# EasyEDA Pro project ProPrj_NavBot-ES02.epro, board MAIN
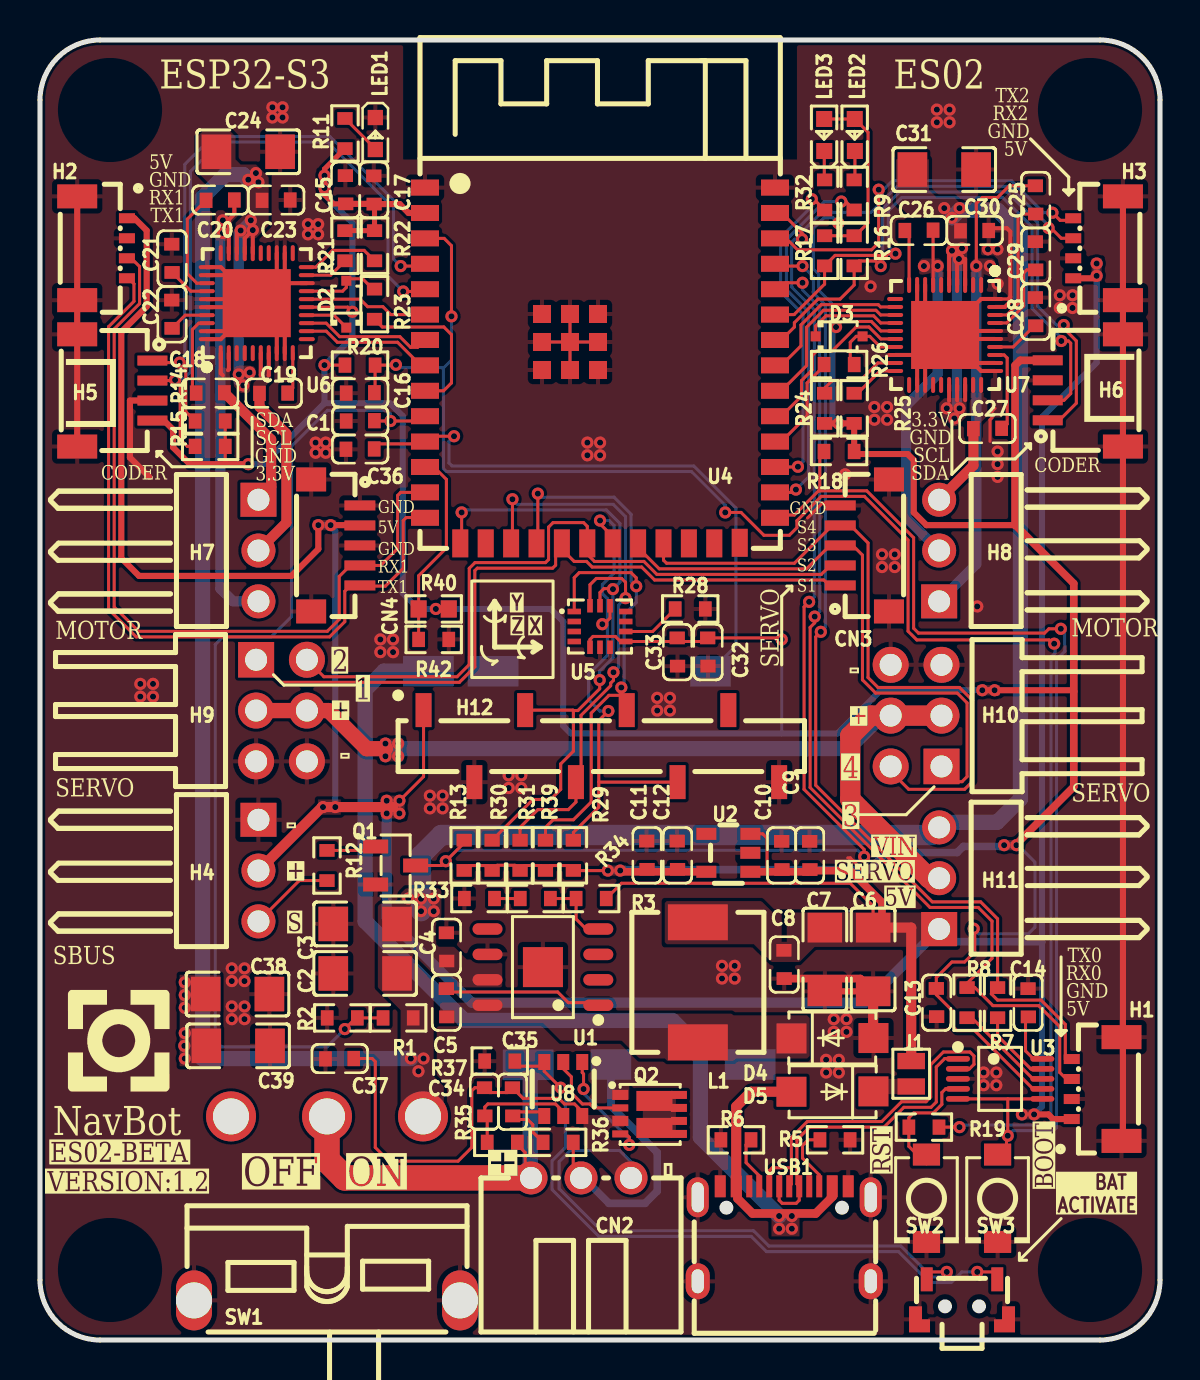
[diagram p3: board, top side]
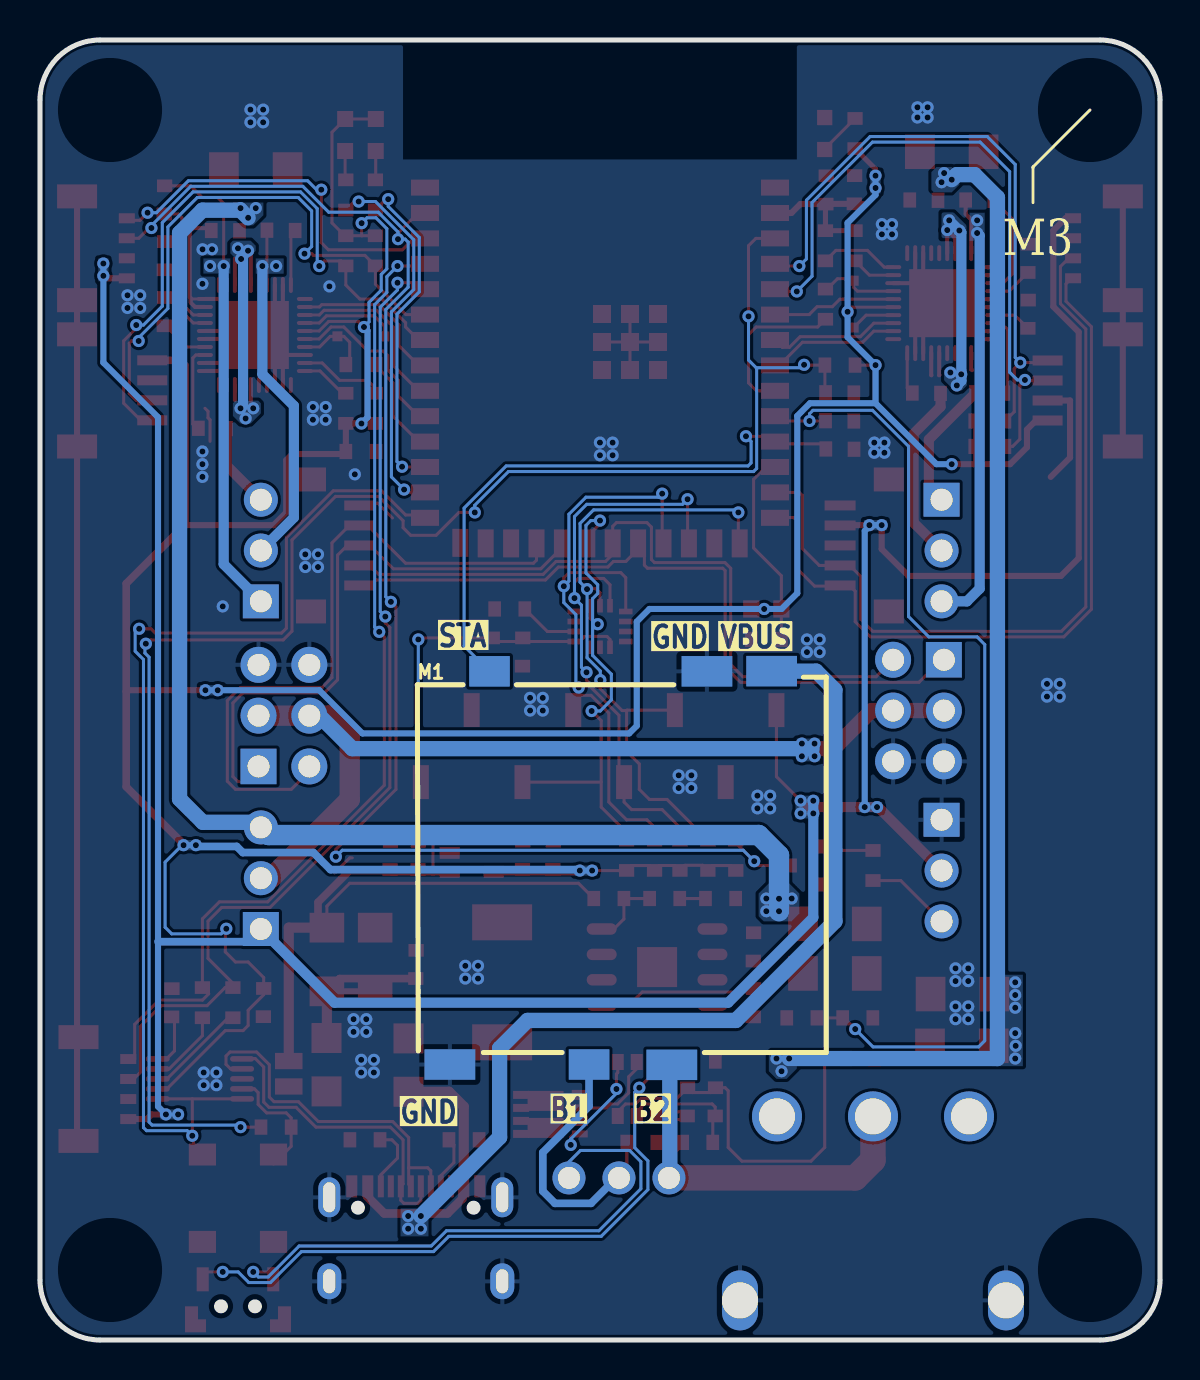
[diagram p4: board, bottom side, seen from below]

Outline 56 x 65 mm; copper layers: Top Layer, Bottom Layer. Coordinates in mm from the lower left corner of the outline.
Outline path: 0,62 0,3 arc(0.88,0.88) 3,0 53,0 arc(55.12,0.88) 56,3 56,62 arc(55.12,64.12) 53,65 3,65 arc(0.88,64.12) 0,62
Stack: Top Layer 0.035mm / Dielectric1 1.51mm FR4 er 4.5 / Bottom Layer 0.035mm

## Design rules (mm)
spacing copperThickness1oz (default): track to track 0.127, other pairs 0.127 to 0.3
spacing copperThickness2oz: track to track 0.203, other pairs 0.152 to 0.3
spacing Plane_innerPlane: track to track 0.127, other pairs 0.127 to 0.3
spacing Copper_铺铜直连: track to track 0.127, other pairs 0.127 to 0.3
spacing Copper_铺铜发散: track to track 0.127, other pairs 0.127 to 0.3
track width copperThickness1oz (default): min 0.127, default 0.152, max 2.54
track width copperThickness2oz: min 0.203, default 0.254, max 2.54
differential pair differentialPair (default): width min 0.127, default 0.254, max 2.54; gap min 0.152, default 0.152
net GND uses 铺铜发散
net W_A uses 铺铜发散
net U_B uses 铺铜发散
net V_B uses 铺铜发散
net W_B uses 铺铜发散
pour e1494 uses Copper_铺铜直连, 铺铜直连_Copper_铺铜直连
pour e1496 uses Copper_铺铜直连, 铺铜直连_Copper_铺铜直连
pour e1497 uses Copper_铺铜直连, 铺铜直连_Copper_铺铜直连
pour e1499 uses Copper_铺铜直连, 铺铜直连_Copper_铺铜直连
pour e1501 uses Copper_铺铜发散, 铺铜直连_Copper_铺铜发散
pour e1502 uses Copper_铺铜发散, 铺铜直连_Copper_铺铜发散
pour e1503 uses Copper_铺铜发散, 铺铜直连_Copper_铺铜发散
pour e1505 uses Copper_铺铜发散, 铺铜直连_Copper_铺铜发散
pour e1509 uses Copper_铺铜直连, 铺铜直连_Copper_铺铜直连
pour e1510 uses Copper_铺铜直连, 铺铜直连_Copper_铺铜直连
pour e1511 uses Copper_铺铜直连, 铺铜直连_Copper_铺铜直连
pour e1515 uses Copper_铺铜直连, 铺铜直连_Copper_铺铜直连
pour e1516 uses Copper_铺铜直连, 铺铜直连_Copper_铺铜直连
pour e1518 uses Copper_铺铜直连, 铺铜直连_Copper_铺铜直连
pour e1520 uses Copper_铺铜直连, 铺铜直连_Copper_铺铜直连
pour e1522 uses Copper_铺铜发散, 铺铜直连_Copper_铺铜发散
pour e1839 uses Copper_铺铜发散, 铺铜直连_Copper_铺铜发散

## Placement (name value [footprint] x y rotation side)
C1  100nF  [C0603]  16.01 45.95 0 top
C2  22uF  [C1206]  16.26 18.33 0 top
C3  22uF  [C1206]  16.26 20.8 0 top
C4  100nF  [C0603]  20.32 19.66 270 top
C5  100nF  [C0603]  20.32 16.87 270 top
C6  22uF  [C1206]  41.66 19.03 90 top
C7  22uF  [C1206]  39.24 19.03 90 top
C8  100nF  [C0603]  37.21 18.77 90 top
C9  10uF  [C0603]  38.48 24.23 270 top
C10  100nF  [C0603]  37.08 24.23 270 top
C11  10uF  [C0603]  30.35 24.23 90 top
C12  100nF  [C0603]  31.88 24.23 90 top
C13  1uF  [C0603]  44.83 16.87 90 top
C14  1uF  [C0603]  49.4 16.87 270 top
C15  22uF  [C0603]  15.28 57.51 90 top
C16  100nF  [C0603]  16.01 47.35 0 top
C17  100nF  [C0603]  16.69 57.51 270 top
C18  100nF  [C0603]  8.51 47.35 0 top
C19  100nF  [C0603]  11.68 47.35 180 top
C20  100nF  [C0603]  9.02 57 180 top
C21  10uF  [C0603]  6.6 54.08 90 top
C22  10uF  [C0603]  6.6 51.28 90 top
C23  100nF  [C0603]  11.81 57 180 top
C24  100uF  [C1206]  10.41 59.41 180 top
C25  100nF  [C0603]  49.78 57 90 top
C26  100nF  [C0603]  43.94 55.47 0 top
C27  100nF  [C0603]  47.37 45.57 0 top
C28  10uF  [C0603]  49.78 51.41 90 top
C29  10uF  [C0603]  49.78 54.2 90 top
C30  100nF  [C0603]  46.74 55.47 180 top
C31  100uF  [C1206]  45.21 58.52 180 top
C32  10uF  [C0603]  33.4 34.39 90 top
C33  100nF  [C0603]  31.88 34.39 90 top
C34  10nF  [C0603]  22.22 11.91 270 top
C35  10nF  [C0603]  23.62 11.91 270 top
C36  100nF  [C0603]  16.01 44.55 180 top
C37  100nF  [C0603]  14.99 14.07 180 top
C38  22uF  [C1206]  9.88 17.3 180 top
C39  22uF  [C1206]  9.91 14.71 180 top
CN2  HX25003-3WAP  [CONN-TH_3P-P2.50_HX25003-3WAP]  27.05 8.1 0 top
CN3  WAFER-SH1.0-5PLB  [CONN-SMD-5P-P1.00_BM05B-SRSS-TB-LF-SN]  41.28 39.73 90 top
CN4  WAFER-SH1.0-5PLB  [CONN-SMD-5P-P1.00_BM05B-SRSS-TB-LF-SN]  14.73 39.73 270 top
D2  SD103AWS  [SOD-323_L1.8-W1.3-LS2.5-RD]  15.32 51.79 90 top
D3  SD103AWS  [SOD-323_L1.8-W1.3-LS2.5-RD]  39.96 50.18 0 top
D4  SS54  [SMA_L4.3-W2.6-LS5.0-FD]  39.62 15.09 180 top
D5  SS54  [SMA_L4.3-W2.6-LS5.0-FD]  39.62 12.42 0 top
H1  WAFER-SH1.0-4PLB  [CONN-SMD_4P-P1.00-C3029334]  52.83 12.55 90 top
H2  WAFER-SH1.0-4PLB  [CONN-SMD_4P-P1.00-C3029334]  3.1 54.59 270 top
H3  WAFER-SH1.0-4PLB  [CONN-SMD_4P-P1.00-C3029334]  52.9 54.59 90 top
H4  PZ254R-11-03P  [HDR-TH_3P-P2.54-H-M-W10.4]  10.92 23.47 270 top
H5  1.0-4PWB  [CONN-SMD_4P-P1.00_DEALON_1.0-4PWB]  3.81 47.47 270 top
H6  1.0-4PWB  [CONN-SMD_4P-P1.00_DEALON_1.0-4PWB]  52.2 47.48 90 top
H7  PZ254R-11-03P  [HDR-TH_3P-P2.54-H-M-W10.4]  10.92 39.47 270 top
H8  PZ254R-11-03P  [HDR-TH_3P-P2.54-H-M-W10.4]  44.96 39.47 90 top
H9  PH2.54-07-03PWS  [HDR-TH_6P-P2.54-H-M-R2-C3-S2.54-W12.3-N]  12.08 31.47 270 top
H10  PH2.54-07-03PWS  [HDR-TH_6P-P2.54-H-M-R2-C3-S2.54-W12.3-N]  43.8 31.22 90 top
H11  PZ254R-11-03P  [HDR-TH_3P-P2.54-H-M-W10.4]  44.96 23.09 90 top
H12  -  [HDR-SMD_8P-P2.54-V-F-LS4.9]  28.07 29.69 0 top
J1  -  [0805短接点_FG]  43.56 13.31 270 top
L1  10uH  [IND-SMD_L7.3-W6.8]  32.89 17.88 90 top
LED1  KT-0603R  [LED0603-RD]  16.76 60.32 270 top
LED2  -  [LED_0603]  40.73 60.3 90 top
LED3  -  [LED_0603]  39.2 60.3 90 top
M1  -  [2S充电模块]  26.92 23.6 180 bottom
Q1  SS8050(RANGE:200-350)  [SOT-23-3_L2.9-W1.3-P1.90-LS2.4-BR]  17.78 23.72 180 top
Q2  WSD3056DN33  [POWERPAK-SO-8_L3.0-W3.0-P0.65-BL]  30.48 11.28 270 top
R1  10kΩ  [R0603#2]  17.91 16.11 0 top
R2  1kΩ  [R0603#2]  15.11 16.11 0 top
R3  10kΩ  [R0603#2]  27.56 22.07 0 top
R5  4.7kΩ  [R0603#2]  39.75 10.01 180 top
R6  4.7kΩ  [R0603#2]  34.8 10.01 0 top
R7  1kΩ  [R0603#2]  47.88 16.87 270 top
R8  1kΩ  [R0603#2]  46.35 16.87 270 top
R9  3.3kΩ  [R0603#2]  40.71 57.25 90 top
R11  3.3kΩ  [R0603#2]  15.25 60.32 270 top
R12  10kΩ  [R0603#2]  14.35 23.72 90 top
R13  10kΩ  [R0603#2]  21.21 24.23 270 top
R14  3.3kΩ  [R0603#2]  8.51 45.95 0 top
R15  3.3kΩ  [R0603#2]  8.51 44.68 0 top
R16  3.3kΩ  [R0603#2]  40.71 54.46 90 top
R17  3.3kΩ  [R0603#2]  39.23 54.46 90 top
R18  10kΩ  [R0603#2]  39.95 44.43 0 top
R19  1kΩ  [R0603#2]  44.2 10.64 180 top
R20  51kΩ  [R0603#2]  16 48.74 180 top
R21  100kΩ  [R0603#2]  15.25 54.71 270 top
R22  100kΩ  [R0603#2]  16.73 54.71 270 top
R23  1kΩ  [R0603#2]  16.73 51.79 90 top
R24  100kΩ  [R0603#2]  39.23 46.58 90 top
R25  100kΩ  [R0603#2]  40.71 46.58 90 top
R26  1kΩ  [R0603#2]  39.96 48.77 0 top
R28  10kΩ  [R0603#2]  32.51 36.55 180 top
R29  4.7kΩ  [R0603#2]  26.67 24.23 270 top
R30  4.7kΩ  [R0603#2]  22.61 24.23 270 top
R31  4.7kΩ  [R0603#2]  24 24.23 270 top
R32  3.3kΩ  [R0603#2]  39.23 57.25 90 top
R33  200Ω  [R0603#2]  21.97 22.07 0 top
R34  3kΩ  [R0603#2]  24.76 22.07 0 top
R35  330Ω  [R0603#2]  23.11 9.88 180 top
R36  330Ω  [R0603#2]  25.91 9.88 180 top
R37  2kΩ  [R0603#2]  22.99 13.95 0 top
R39  100kΩ  [R0603#2]  25.27 24.23 270 top
R40  180kΩ  [R0603]  19.69 36.55 180 top
R42  100kΩ  [R0603#2]  19.69 35.03 0 top
SW1  SS-12D11G5R  [SW-TH_SS-12D11G5R]  14.35 6.58 180 top
SW2  TS-1088-AR02016  [SW-SMD_L3.9-W3.0-P4.45]  44.32 7.09 270 top
SW3  TS-1088-AR02016  [SW-SMD_L3.9-W3.0-P4.45]  47.88 7.09 270 top
SW4  TS24CA  [SW-SMD_2P-TS24CA]  46.1 2.01 180 top
U1  RT8289GSP  [SOIC-8_L5.0-W4.0-P1.27-LS6.0-BL-EP2.0]  25.15 18.64 90 top
U2  XC6210B332MR  [SOT-23-5_L2.9-W1.6-P0.95-LS2.8-BR]  34.42 24.36 0 top
U3  CH340X  [MSOP-10_L3.0-W3.0-P0.50-LS5.0-BL]  48.01 13.06 270 top
U4  ESP32-S3-WROOM-1-N8R8  [WIRELM-SMD_ESP32-S3-WROOM-1]  28 48.73 0 top
U5  ICM-42688P-HXY  [LGA-14_L3.0-W2.5-P0.50-TL]  28 35.67 0 top
U6  MP6536DU-LF-Z  [QFN-40_L5.0-W5.0-P0.40-TL-EP3.4]  10.84 51.84 90 top
U7  MP6536DU-LF-Z  [QFN-40_L5.0-W5.0-P0.40-TL-EP3.4]  45.26 50.25 270 top
U8  HY2120-LB  [SOT-23-6_L2.9-W1.6-P0.95-LS2.8-BR]  26.16 12.55 90 top
USB1  TYPE-C 16PIN 2MD(073)  [USB-C-SMD_TYPE-C-6PIN-2MD-073]  37.21 5.31 0 top

## Footprints (pads in the part's own frame, mm; a bottom-side part is the same pattern mirrored in y, then rotated)
2S充电模块
  rect 2.54x1.524 smd: 1(7.505,9.845) 2(4.271,9.835) 4(-8.582,-9.825) 6(2.514,-9.841)
  rect 2.032x1.524 smd: 3(-6.601,9.835) 5(-1.623,-9.825)
0805短接点_FG
  rect 0.813x1.377 smd: 1(-0.635,0) 2(0.635,0)
C0603
  rect 0.635x0.762 smd: 1(-0.7,0) 2(0.711,0.016)
C1206
  rect 1.485x1.728 smd: 1(-1.593,0) 2(1.593,0)
CONN-SMD-5P-P1.00_BM05B-SRSS-TB-LF-SN
  rect 0.5x1.55 smd: 1(-2,1.262) 2(-1,1.262) 3(0,1.262) 4(1,1.262) 5(2,1.262)
  rect 1.2x1.5 smd: 6(3.3,-1.173) 7(-3.3,-1.173)
CONN-SMD_4P-P1.00-C3029334
  rect 0.5x0.8 smd: 1(-1.502,1.244) 2(-0.501,1.244) 3(0.501,1.242) 4(1.499,1.244)
  rect 1.2x2 smd: 5(-2.595,-1.244) 6(2.595,-1.244)
CONN-SMD_4P-P1.00_DEALON_1.0-4PWB
  rect 0.5x1.5 smd: 1(-1.5,1.81) 2(-0.5,1.81) 3(0.5,1.81) 4(1.5,1.81)
  rect 1.2x2 smd: 5(2.8,-1.95) 6(-2.81,-1.95)
CONN-TH_3P-P2.50_HX25003-3WAP
  round 1.651 hole 1.1: 1(-2.5,0) 2(0.001,0) 3(2.5,0)
HDR-SMD_8P-P2.54-V-F-LS4.9
  rect 0.8x1.7 smd: 1(-8.89,1.8) 2(-6.35,-1.8) 3(-3.81,1.8) 4(-1.27,-1.8) 5(1.27,1.8) 6(3.81,-1.8) 7(6.35,1.8) 8(8.89,-1.8)
HDR-TH_3P-P2.54-H-M-W10.4
  rect 1.7x1.8 hole 1.1: 1(-2.54,0)
  round 1.7 hole 1.1: 2(0,0) 3(2.54,0)
HDR-TH_6P-P2.54-H-M-R2-C3-S2.54-W12.3-N
  rect 1.778x1.8 hole 1.1: 1(-2.54,-1.27)
  round 1.8 hole 1.1: 2(-2.54,1.27) 3(0,-1.27) 4(0,1.27) 5(2.54,-1.27) 6(2.54,1.27)
IND-SMD_L7.3-W6.8
  rect 1.8x3 smd: 1(-3,0) 2(3,0)
LED0603-RD
  rect 0.762x0.762 smd: 1(-0.799,0) 2(0.799,0)
LED_0603
  rect 0.8x0.8 smd: 1(-0.851,-0.01) 2(0.75,-0.005)
LGA-14_L3.0-W2.5-P0.50-TL
  rect 0.675x0.28 smd: 1(-1.288,0.75) 2(-1.288,0.25) 3(-1.288,-0.25) 4(-1.288,-0.75) 8(1.288,-0.75) 9(1.288,-0.25) 10(1.288,0.25) 11(1.288,0.75)
  rect 0.28x0.675 smd: 5(-0.5,-1.038) 6(0,-1.038) 7(0.5,-1.038) 12(0.5,1.038) 13(0,1.038) 14(-0.5,1.038)
MSOP-10_L3.0-W3.0-P0.50-LS5.0-BL
  oval 0.28x1.2 smd: 1(-1,-2.11) 2(-0.5,-2.11) 3(0,-2.11) 4(0.5,-2.11) 5(1,-2.11) 6(1,2.11) 7(0.5,2.11) 8(0,2.11) 9(-0.5,2.11) 10(-1,2.11)
POWERPAK-SO-8_L3.0-W3.0-P0.65-BL
  rect 0.5x0.8 smd: 1(-0.975,-1.466) 3(0.325,-1.466)
  rect 0.35x0.8 smd: 2(-0.325,-1.466) 4(0.975,-1.466)
  rect 0.4x0.8 smd: 5(0.975,1.466) 6(0.325,1.466) 7(-0.325,1.466) 8(-0.975,1.466)
  rect 1x1.8 smd: 9(-0.675,0.241) 10(0.675,0.241)
QFN-40_L5.0-W5.0-P0.40-TL-EP3.4
  oval 0.8x0.2 smd: 1(-2.5,1.8) 2(-2.5,1.4) 3(-2.5,1) 4(-2.5,0.6) 5(-2.5,0.2) 6(-2.5,-0.2) 7(-2.5,-0.6) 8(-2.5,-1) 9(-2.5,-1.4) 10(-2.5,-1.8) 21(2.5,-1.8) 22(2.5,-1.4) 23(2.5,-1) 24(2.5,-0.6) 25(2.5,-0.2) 26(2.5,0.2) 27(2.5,0.6) 28(2.5,1) 29(2.5,1.4) 30(2.5,1.8)
  oval 0.2x0.8 smd: 11(-1.8,-2.5) 12(-1.4,-2.5) 13(-1,-2.5) 14(-0.6,-2.5) 15(-0.2,-2.5) 16(0.2,-2.5) 17(0.6,-2.5) 18(1,-2.5) 19(1.4,-2.5) 20(1.8,-2.5) 31(1.8,2.5) 32(1.4,2.5) 33(1,2.5) 34(0.6,2.5) 35(0.2,2.5) 36(-0.2,2.5) 37(-0.6,2.5) 38(-1,2.5) 39(-1.4,2.5) 40(-1.8,2.5)
  rect 3.4x3.4 smd: 41(0,0)
R0603
  rect 0.806x0.864 smd: 1(-0.753,0) 2(0.753,0)
R0603#2
  rect 0.635x0.762 smd: 1(-0.753,0) 2(0.753,0)
SMA_L4.3-W2.6-LS5.0-FD
  rect 1.5x1.5 smd: 1(-2.05,-0.009) 2(2.05,0.009)
SOD-323_L1.8-W1.3-LS2.5-RD
  rect 0.5x0.5 smd: 1(-1.173,0) 2(1.173,0)
SOIC-8_L5.0-W4.0-P1.27-LS6.0-BL-EP2.0
  oval 0.574x1.5 smd: 1(-1.905,-2.769) 2(-0.635,-2.769) 3(0.635,-2.769) 4(1.905,-2.769) 5(1.905,2.769) 6(0.635,2.769) 7(-0.635,2.769) 8(-1.905,2.769)
  rect 2x2 smd: 9(0,0)
SOT-23-3_L2.9-W1.3-P1.90-LS2.4-BR
  rect 1.25x0.7 smd: 1(1,-0.95) 2(1,0.95) 3(-1,0)
SOT-23-5_L2.9-W1.6-P0.95-LS2.8-BR
  rect 1x0.6 smd: 1(1.1,-0.95) 2(1.1,0) 3(1.1,0.95) 4(-1.1,0.95) 5(-1.1,-0.95)
SOT-23-6_L2.9-W1.6-P0.95-LS2.8-BR
  rect 0.8x0.6 smd: 1(1.35,-0.95) 2(1.35,0) 3(1.35,0.95) 4(-1.35,0.95) 5(-1.35,0) 6(-1.35,-0.95)
SW-SMD_2P-TS24CA
  rect 0.6x1.2 smd: 1(-1.764,-1.026) 2(1.764,-1.026)
  custom 1.05x1.3 smd: 3(2.125,0.975) 4(-2.125,0.975)
SW-SMD_L3.9-W3.0-P4.45
  rect 1.1x1.36 smd: 1(-2.185,0) 2(2.185,0)
SW-TH_SS-12D11G5R
  round 2.5 hole 1.8: 1(-4.8,-4.6) 2(0,-4.6) 3(4.8,-4.6)
  oval 1.8x3 hole 1.8: 4(6.65,4.6) 5(-6.65,4.6)
USB-C-SMD_TYPE-C-6PIN-2MD-073
  rect 0.55x1.1 smd: 1(-3.2,2.375) 2(-2.4,2.375) 11(2.4,2.375) 12(3.2,2.375)
  rect 0.3x1.1 smd: 3(-1.75,2.375) 4(-1.25,2.375) 5(-0.75,2.375) 6(-0.25,2.375) 7(0.25,2.375) 8(0.75,2.375) 9(1.25,2.375) 10(1.75,2.375)
  oval 1.1x2 hole 0.6x1.5: 13(-4.325,1.825) 14(4.325,1.825)
  oval 1.2x1.8 hole 0.6x1.2: 13(-4.325,-2.375) 14(4.325,-2.375)
WIRELM-SMD_ESP32-S3-WROOM-1
  rect 1.4x0.8 smd: 1(-8.75,8.895) 2(-8.75,7.625) 3(-8.75,6.355) 4(-8.75,5.085) 5(-8.75,3.815) 6(-8.75,2.545) 7(-8.75,1.275) 8(-8.75,0.005) 9(-8.75,-1.265) 10(-8.75,-2.535) 11(-8.75,-3.805) 12(-8.75,-5.075) 13(-8.75,-6.345) 14(-8.75,-7.615) 27(8.75,-7.615) 28(8.75,-6.345) 29(8.75,-5.075) 30(8.75,-3.805) 31(8.75,-2.535) 32(8.75,-1.265) 33(8.75,0.005) 34(8.75,1.275) 35(8.75,2.545) 36(8.75,3.815) 37(8.75,5.085) 38(8.75,6.355) 39(8.75,7.625) 40(8.75,8.895)
  rect 0.8x1.4 smd: 15(-6.985,-8.895) 16(-5.715,-8.895) 17(-4.445,-8.895) 18(-3.175,-8.895) 19(-1.905,-8.895) 20(-0.635,-8.895) 21(0.635,-8.895) 22(1.905,-8.895) 23(3.175,-8.895) 24(4.445,-8.895) 25(5.715,-8.895) 26(6.985,-8.865)
  rect 0.9x0.9 smd: 41(-2.9,2.575) 41(-2.9,1.175) 41(-2.9,-0.225) 41(-1.5,2.575) 41(-1.5,1.175) 41(-1.5,-0.225) 41(-0.1,2.575) 41(-0.1,1.175) 41(-0.1,-0.225)

## Nets
As in the schematic.

Pads without a net: H12 7; SW1 3; U1 2 3 5; U2 4; U4 16 24 25 26; U5 2 3 10 11; U6 11 21 24 25; U7 11 21 24 25; USB1 3 9

## Via types
v1: diameter 0.61, hole 0.305, Top Layer to Bottom Layer, 210 vias

## Routing (per net, layer and track width the routed paths; a pad name or vN(x,y) marks a point on that pad's centre or on a via; arc(x,y) is an arc through that point)
+3.3V: length 231.1
  Top Layer w0.152: v1(39.8,50.65) 40.08,50.93 41.56,50.93 42.04,50.45 U7.15 ; v1(15.62,51.41) 15.39,51.64 U6.15 ; 39.9,55.21 39.92,55.23 v1(39.92,55.84) ; 39.9,55.21 R17.2 ; 39.9,55.21 R16.2 40.76,55.21 41.4,55.86 41.4,60.39 LED2.2 LED3.2 ; v1(37.08,35.03) 37.01,35.1 33.38,35.1 33.21,34.92 U5.8 29.26,34.9 29.05,34.9 28.77,35.18 27.65,35.18 27.5,35.03 U5.5 ; v1(39.93,45.82) 39.94,45.83 ; R14.2 R15.2 9.26,43.83 9.3,43.79 ; R13.2 21.45,23.72 22.36,23.72 R30.2 22.86,23.74 23.75,23.74 R31.2 24.25,23.72 25.03,23.72 R39.2 25.52,23.72 26.43,23.72 R29.2 26.68,23.47 v1(28.39,23.47) ; v1(14.22,48.74) R20.2 ; R40.1 v1(19.79,36.55) ; v1(46.69,20.56) 46.74,20.51 46.74,19.41 46.23,18.9 45.59,18.9 44.81,18.12 C13.2 44.81,17.26 45.59,16.49 45.59,15.72 45.85,15.47 46.74,15.47 49.65,12.56 U3.7
  Top Layer w0.254: 15.25,59.57 14.22,58.55 v1(14.22,58.22) v1(14.22,57.6) 14.22,57.25 14.67,56.81 C15.1 ; R21.1 R22.1 16.73,56.78 C17.2 16.69,56.81
  Top Layer w0.305: 14.1,57.48 v1(14.22,57.6) ; R24.1 R25.1 40.71,44.3 43.38,44.3 43.69,43.99 43.69,41.38 44.32,40.74 48.75,40.74 ; C17.2 17.98,56.8 18.43,56.35 U4.2 ; v1(47.73,32.49) 51.63,32.49 51.69,32.43 ; v1(47.73,32.49) 47.85,32.36 ; v1(47.73,32.49) 47.42,32.49 ; H5.4 6.2,45.97 6.65,45.52 6.65,44.63 7.49,43.79 v1(10.41,43.79) ; 16.69,56.81 C15.1
  Top Layer w0.381: 48.77,24.74 51.69,27.66 51.69,37.82 48.77,40.74 48.75,40.74 48.75,48.73 49.01,48.98 H6.4 ; v1(29.01,23.47) 29.07,23.41 U2.5
  Bottom Layer w0.152: v1(39.8,50.65) 39.55,50.9 39.55,51.88 38.94,52.49 38.94,53.28 38.66,53.56 38.66,55.57 39.2,56.11 39.65,56.11 v1(39.92,55.84) ; v1(37.08,35.03) 37.08,30.33 ; 14.22,57.63 14.1,57.76 ; v1(46.69,20.56) 46.94,20.31 49.42,20.31 49.74,20.64 49.74,23.89 48.9,24.74
  Bottom Layer w0.305: v1(48.82,24.74) v1(48.21,24.74) ; 14.22,46.84 v1(14.22,48.74) 15.62,50.14 v1(15.62,51.41) 15.62,55.86 14.22,57.25 v1(14.22,57.6) v1(14.22,58.22) ; 14.22,46.84 17.5,46.84 18.14,46.2 18.14,37.34 18.92,36.55 v1(19.79,36.55) 25.53,36.55 26.16,35.92 26.16,30.71 26.54,30.33 39.88,30.33 42.04,32.49 v1(47.11,32.49) v1(47.73,32.49) ; 14.22,46.84 11.18,43.79 v1(10.41,43.79) ; v1(39.93,45.82) 39.62,46.13 39.62,50.47 v1(39.8,50.65) ; v1(29.01,23.47) v1(28.39,23.47)
  Bottom Layer w0.381: v1(29.01,23.47) 29.06,23.52 41.48,23.52 42.33,24.37 45.86,24.37 46.16,24.68 48.14,24.68 v1(48.21,24.74)
+5V: length 183.8
  Top Layer w0.152: R3.2 29.07,22.84 40.51,22.84 41.66,21.69 C6.2 ; 19.18,31.49 19.18,28.17 v1(17.97,26.96) ; U2.3 36.13,25.31 36.35,25.09 36.35,23.41
  Top Layer w0.305: v1(13.92,40.74) 13.92,39.55 12.57,38.2 4.95,38.2 4.06,39.09 4.06,50.4 5.33,51.67 5.33,55.47 4.72,56.09 4.35,56.09 ; v1(49.7,11.28) 50.42,11.28 50.65,11.05 H1.1 ; 51.66,53.08 52.71,53.08 v1(52.83,53.21) ; v1(14.53,40.74) 15.98,40.74 CN4.2
  Top Layer w0.381: U2.1 38.38,23.41 C9.2 38.55,23.47 40.51,23.47 42.1,21.88 42.1,21.06 C6.2
  Top Layer w0.508: 17.65,26.65 v1(14.76,26.65) 14.1,26.65 H4.2 ; C6.2 43.56,20.62 J1.1
  Bottom Layer w0.305: v1(52.83,53.82) v1(52.83,53.21) 52.83,48.87 50.1,46.14 50.1,11.67 v1(49.7,11.28) ; v1(14.76,26.65) 14.76,40.46 14.48,40.74 v1(13.92,40.74)
  Bottom Layer w0.381: H11.1 45.59,19.92 50.1,19.92
  Bottom Layer w0.508: H11.1 41.28,16.87 21.59,16.87 17.34,21.12 v1(17.34,26.33) v1(17.34,26.96)
  vias: v1(14.15,26.65) v1(17.97,26.33) v1(49.1,11.28)
GND: length 129.3
  Top Layer w0.152: 47.75,46.58 47.6,46.43 47.6,46.11 47.5,46.01 47.5,44.93 ; 40.39,24.11 40.51,24.11 41.28,23.34 ; U4.41 U4.41 ; U4.41 U4.41 ; U4.41 U4.41 ; U4.41 U4.41 ; 48.46,52.09 48.42,52.05 U7.40 ; 39.62,41.84 39.11,41.84 38.38,41.1
  Top Layer w0.203: U7.32 46.66,48.85 47.06,48.45 U7.31 ; U6.32 9.44,53.24 9.04,53.64 U6.31 ; 11.84,50.84 12.24,50.44 U6.9 ; 11.84,50.84 U6.41 10.64,52.04 U6.35 ; 11.84,50.84 U6.8 ; 44.26,51.25 U7.41 45.46,50.05 U7.35 ; 44.26,51.25 U7.8 ; 44.26,51.25 43.86,51.65 U7.9 ; U7.36 45.46,50.45 47.06,52.05 U7.40 ; U6.18 11.84,52.84 ; 11.84,52.84 12.24,53.24 U6.22 ; 11.84,52.84 U6.23 ; U6.36 10.64,51.64 ; U7.23 44.26,49.25 ; 44.26,49.25 U7.18 ; 44.26,49.25 43.86,48.85 U7.22 ; U7.39 48.25,51.65 48.46,51.87 48.46,52.09 48.51,52.14 48.51,55.42 48.35,55.59 47.55,55.59 C30.1 ; U6.40 9.04,50.04 9.44,50.44 U6.39
  Top Layer w0.305: H5.5 H5.6 H2.6 H2.5 ; H5.3 4.5,46.97 4.5,44.12 5.46,43.16 ; H3.6 H3.5 H6.5 H6.6 54.15,10.03 H1.5 ; C7.1 C6.1
  Top Layer w0.381: C8.1 41.02,18.07 C6.1
  Top Layer w0.508: C6.1 41.66,15.12 D4.1
  vias: v1(5.02,32.81) v1(5.02,32.17) v1(5.65,32.81) v1(5.65,32.17) v1(9.59,18.58) v1(9.59,17.95) v1(9.59,16.68) v1(9.59,16.04) v1(10.22,18.58) v1(10.22,17.95) v1(10.22,16.68) v1(10.22,16.04) v1(11.62,61.63) v1(11.62,61.13) v1(12.13,61.63) v1(12.13,61.13) v1(13.4,55.79) v1(13.4,55.28) v1(13.78,44.87) v1(13.78,44.36) v1(13.91,55.79) v1(13.91,55.28) v1(14.29,44.87) v1(14.29,44.36) v1(17.02,35.03) v1(17.02,34.39) v1(17.65,35.03) v1(17.65,34.39) v1(19.49,27.22) v1(19.49,26.58) v1(20.13,27.22) v1(20.13,26.58) v1(23.43,28.23) v1(23.43,27.6) v1(24.07,28.23) v1(24.07,27.6) v1(27.37,44.87) v1(27.37,44.24) v1(28,44.87) v1(28,44.24) v1(30.86,32.11) v1(30.86,31.47) v1(31.5,32.11) v1(31.5,31.47) v1(34.1,18.71) v1(34.1,18.07) v1(34.73,18.71) v1(34.73,18.07) v1(39.31,14.01) v1(39.31,13.37) v1(39.69,16.04) v1(39.69,15.41) v1(39.94,14.01) v1(39.94,13.37) v1(40.26,43.28) v1(40.32,16.04) v1(40.32,15.41) v1(41.53,52.68) v1(41.72,46.65) v1(41.72,46.01) v1(42.1,39.28) v1(42.1,38.65) v1(42.35,46.65) v1(42.35,46.01) v1(42.74,39.28) v1(42.74,38.65) v1(44.84,61.52) v1(44.84,60.88) v1(45.48,61.52) v1(45.48,60.88) v1(46.86,36.68) v1(47.18,13.37) v1(47.18,12.74) v1(47.4,54.53) v1(47.82,13.37) v1(47.82,12.74) v1(47.87,54.53) v1(47.88,52.81) v1(47.88,44.43) v1(47.88,43.79) v1(47.88,43.16) v1(50.99,52.24) v1(50.99,51.6) v1(51.63,52.24) v1(51.63,51.6)
VBUS: length 58.2
  Top Layer w0.432: USB1.11 39.63,7.67 39.63,7.17 38.79,6.33 35.63,6.33 34.87,7.08 34.87,7.62 USB1.2
  Top Layer w0.508: USB1.2 34.81,11.67 35.55,12.41 D5.1
  Bottom Layer w0.762: v1(36.96,6.2) 33.02,10.14 33.02,14.58 31.62,15.98 21.21,15.98 16.26,20.93 16.26,32.5 17.2,33.44 M1.1
  vias: v1(36.96,5.56) v1(37.59,6.2) v1(37.59,5.56)
VIN: length 149.9
  Top Layer w0.203: U7.28 46.26,46.99 ; U6.26 v1(10.64,55.49) 10.24,55.09 U6.27 ; v1(45.6,54.46) 45.46,54.32 U7.5 ; 9.84,55.47 U6.28 ; U7.26 45.46,46.96 ; U7.4 45.86,53.96 v1(45.95,54.05) 46.26,54.05 U7.3 ; U7.27 45.86,46.97
  Bottom Layer w0.508: v1(10.16,47.73) 9.93,47.96 9.93,55.37 v1(10.54,55.98) ; v1(45.6,54.46) 45.85,54.22 45.85,46.71 v1(45.97,46.58)
  Bottom Layer w0.762: v1(45.59,56.11) 45.97,56.49 47.88,56.49 49.02,55.35 49.02,27.05 47.86,25.88 45.21,25.88 H11.3 ; v1(10.41,58.02) 10.16,58.27 9.27,58.27 8.13,57.13 8.13,14.07 v1(18.54,14.07)
  Bottom Layer w1.016: H11.3 44.58,25.25 20.07,25.25 19.05,24.23 v1(19.05,22.06) v1(19.05,21.44)
  vias: v1(7.24,17.88) v1(7.24,17.25) v1(7.24,16.61) v1(7.24,15.34) v1(7.22,14.71) v1(7.24,14.07) v1(9.94,48.28) v1(10.03,55.47) v1(10.48,48.37) v1(10.79,58.35) v1(10.92,57.89) v1(18.41,22.07) v1(18.92,13.44) v1(19.18,14.07) v1(19.69,22.07) v1(19.69,21.44) v1(45.21,56.59) v1(45.34,46.58) v1(45.72,46.08) v1(45.97,56.59) v1(46.1,54.59)
ADC: length 50.7
  Top Layer w0.152: v1(15.24,15.55) 15.8,16.11 R2.2 R1.1 ; U4.10 19.25,45.95 v1(17.53,45.95) 16.74,45.95 C1.2
  Bottom Layer w0.152: v1(17.53,45.95) 17.53,46.31 17.35,46.48 14.37,46.48 12.57,44.69 12.57,36.17 11.56,35.16 9.14,35.16 8.76,34.77 8.76,14.96 9.07,14.66 14.35,14.66 v1(15.24,15.55)
B1: length 13.8
  Top Layer w0.152: R36.1 26.66,8.49 CN2.2
  Bottom Layer w0.381: CN2.2 27.18,8.1 28.45,6.83 30.25,6.83 30.86,7.44 30.86,9.37 28.55,11.69 M1.5
B2: length 20.5
  Top Layer w0.152: CN2.1 24.26,8.4 24.26,9.37 23.87,9.76 R35.1
  Top Layer w1.27: CN2.1 15.24,8.1 14.35,8.99 SW1.2
  Bottom Layer w0.762: CN2.1 24.51,8.14 24.51,13.44 24.73,13.65
B-: length 49.1
  Top Layer w0.152: C37.1 16.61,14.07 16.76,13.92 16.76,9.63 17.45,8.94 20.9,8.94 21.59,9.63 21.59,12.46 21.74,12.61 C34.1 22.47,12.37 23.38,12.37 C35.1 24.15,12.08 25.94,12.08 26.22,11.8 26.72,11.8 27.11,11.41 U8.6 ; SW4.2 44.34,3.41 v1(45.34,3.41)
  Bottom Layer w0.152: v1(45.34,3.41) 45.09,3.15 44.59,3.15 43.04,4.7 36.44,4.7 35.68,5.46 28.06,5.46 25.96,7.56 25.96,8.92 26.52,9.48 28.98,9.48 29.55,8.91 CN2.3
BOOT: length 58.1
  Top Layer w0.152: 48.39,12.06 v1(48.39,10.21) 48.32,10.15 48.32,9.37 47.88,8.93 ; 48.39,12.06 U3.6 ; 48.39,12.06 U3.5 ; R18.1 38.99,44.21 38.99,42.46 ; 38.99,42.46 38.93,42.46 37.72,41.25 36.89,41.25 U4.27 ; 38.99,42.46 41.34,42.46 43.68,40.11 43.68,35.59 43.92,35.35 50.23,35.35 50.44,35.56 v1(51.04,35.56)
  Bottom Layer w0.152: v1(48.39,10.21) 48.64,10.47 50.67,10.47 50.83,10.62 50.83,34.02 51.24,34.44 51.24,35.6 51.2,35.56 v1(51.04,35.56)
CS: length 33.6
  Top Layer w0.152: v1(26.03,12.61) 25.21,13.44 25.21,13.69 ; v1(46.86,3.41) 47.86,3.41 SW4.1 ; 25.21,13.69 23.74,13.69 R37.2 ; 25.21,13.69 U8.3
  Bottom Layer w0.152: v1(46.86,3.41) 46.09,3.41 45.56,2.87 44.47,2.87 42.93,4.42 36.32,4.42 35.56,5.18 27.94,5.18 25.6,7.52 25.6,8.96 26.26,9.62 26.26,12.39 v1(26.03,12.61)
CS1: length 25.1
  Top Layer w0.152: 27.94,27.89 27.94,30.97 v1(28.42,31.45) ; 27.94,27.89 27.94,26.65 26.67,25.38 R29.1 ; 27.94,27.89 H12.6 ; v1(28,40.97) 28,40.81 28.63,40.17 U4.21 ; v1(28.12,35.79) 28.19,35.79 28.5,36.1 U5.12
  Bottom Layer w0.152: v1(28.42,31.45) 27.99,31.45 27.43,32.01 27.43,33.29 28.37,34.23 28.37,37.07 28.12,37.32 28.12,37.76 28.7,38.35 28.7,40.73 28.46,40.97 v1(28,40.97)
D+: length 15.7
  Top Layer w0.152: USB1.6 36.96,7.68 36.96,6.99 37.11,6.83 37.81,6.83 37.96,6.99 USB1.8 37.85,7.8 37.85,10.01 38.48,10.64 42.2,10.64 43.19,11.63 44.55,11.63 44.81,11.9 44.81,13.65 45.24,14.07 45.88,14.07 U3.1
D-: length 17.7
  Top Layer w0.152: USB1.5 36.46,8.46 36.61,8.61 37.57,8.61 ; USB1.7 37.57,7.79 37.57,8.61 ; 37.57,8.61 37.57,10.12 38.37,10.92 42.09,10.92 43.08,11.91 44.3,11.91 44.53,12.15 44.53,13.77 45.17,14.4 46.5,14.4 46.7,14.2 46.7,13.78 46.47,13.56 U3.2
EN_A: length 8.1
  Top Layer w0.152: R23.1 17.12,50.65 20.19,50.65 20.57,50.27 20.57,47.86 20.18,47.46 U4.9
EN_B: length 5.1
  Top Layer w0.152: U4.30 37.07,44.92 38.35,46.2 38.35,47.86 39.2,48.7 R26.1
INT2: length 2.9
  Top Layer w0.152: U5.9 30.63,35.42 R28.2
LED2: length 18.7
  Top Layer w0.152: R9.1 40.28,56.92 v1(40.07,56.92) ; U4.28 37.65,42.38 v1(37.8,42.52)
  Bottom Layer w0.152: v1(37.8,42.52) 38.43,43.16 38.43,51.41 37.31,52.53 37.31,55.01 39.23,56.92 v1(40.07,56.92)
LED3: length 16.6
  Top Layer w0.152: U4.29 37.88,43.65 v1(37.9,43.66) ; v1(38.59,57.04) 38.69,57.04 R32.1
  Bottom Layer w0.152: v1(38.59,57.04) 38.59,56.68 37.03,55.13 37.03,52.41 38.15,51.29 38.15,43.92 v1(37.9,43.66)
MISO: length 33.1
  Top Layer w0.152: R39.1 25.27,25.63 25.65,26.01 26.67,26.01 27.56,26.9 27.56,31.34 28.45,32.23 29.07,32.23 ; 29.07,32.23 29.07,32.11 29.08,32.09 29.08,31.75 29.34,31.49 ; 29.07,32.23 v1(29.07,32.62) ; U5.1 26.71,38.12 26.96,38.37 29.55,38.37 29.81,38.11 v1(29.81,37.69) ; U4.18 24.89,39.9 v1(24.89,42.32)
  Bottom Layer w0.152: v1(24.89,42.32) 25.07,42.14 28.7,42.14 29.56,41.29 29.56,37.94 v1(29.81,37.69) 29.81,36.87 29.21,36.27 29.21,32.77 v1(29.07,32.62)
MOSI: length 31.3
  Top Layer w0.152: v1(23.62,42.04) 23.62,39.9 U4.17 ; R31.1 24,25.63 24.89,26.52 26.42,26.52 26.8,26.9 H12.4 27.05,28.15 27.05,31.23 28.53,32.71 28.53,32.85 28.67,32.99 v1(28.67,33.38) ; v1(29.28,37.09) 29.28,37.88 29.08,38.08 27.81,38.08 27.5,37.76 U5.14
  Bottom Layer w0.152: v1(28.67,33.38) 28.93,33.64 28.93,36.74 v1(29.28,37.09) 29.28,41.17 28.66,41.78 23.88,41.78 v1(23.62,42.04)
PWM1_A: length 6.6
  Top Layer w0.152: U6.12 14.31,50.44 14.87,49.89 17.88,49.89 19.03,48.73 U4.8
PWM1_B: length 7.9
  Top Layer w0.152: U4.33 37.07,48.73 38.05,49.71 38.05,50.75 39.06,51.77 41.91,51.77 42.03,51.65 U7.12
PWM2_A: length 6.6
  Top Layer w0.152: U4.7 18.88,49.63 18.53,49.63 17.99,50.17 14.98,50.17 14.31,50.84 U6.13
PWM2_B: length 8.9
  Top Layer w0.152: U7.13 42.03,51.25 41.8,51.49 39.18,51.49 38.33,50.64 38.33,48.72 37.07,47.46 U4.32
PWM3_A: length 6.2
  Top Layer w0.152: U4.6 17.54,51.27 17.15,51.67 16.38,51.67 16.01,52.04 U6.16
PWM3_B: length 9
  Top Layer w0.152: U4.31 36.76,46.2 37.08,46.2 38.07,47.19 38.07,47.97 38.61,48.5 38.61,49.22 38.83,49.44 39.6,49.44 40.81,50.65 41.45,50.65 42.05,50.05 U7.16
RST: length 6.1
  Top Layer w0.152: U3.4 45.28,12.56 45.09,12.37 45.09,11.78 44.67,11.36 43.69,11.36 43.44,11.11 R19.2 43.44,9.68 44.32,8.8
RX0: length 51.5
  Top Layer w0.152: U4.36 36.97,52.54 37.29,52.86 v1(38.13,52.86) ; H1.3 51.31,13.05 50.99,13.38 50.99,15.67 49.93,16.72 47.65,16.72 46.74,17.62 R8.1 46.35,17.84 47.6,19.08 47.6,20.94 46.91,21.63 44.5,21.63 38.51,27.62 38.51,35.63 38.74,35.86 v1(38.74,36.17)
  Bottom Layer w0.152: v1(38.13,52.86) 38.13,52.5 38.99,51.64 38.99,36.42 v1(38.74,36.17)
RX1: length 40.1
  Top Layer w0.152: U4.13 18.03,42.38 17.88,42.23 17.88,39.57 17.03,38.73 CN4.4 15.51,38.73 14.96,38.18 14.96,36.03 14.36,35.43 4.93,35.43 3.71,36.65 3.71,50.55 4.98,51.82 4.98,53.67 4.56,54.08 4.34,54.08
RX2: length 75.6
  Top Layer w0.152: R13.1 21.21,24.86 v1(20.29,23.94) 20.07,23.72 Q1.3 ; H3.3 51.06,55.09 50.55,55.6 v1(50.43,55.6) ; v1(41.21,24.17) 41.21,24.53 38.2,27.53 38.2,36.65 v1(38.46,36.91) ; v1(38.1,55.04) 38.1,55.35 37.1,56.35 U4.39
  Bottom Layer w0.152: v1(50.43,55.6) 50.43,55.72 48.46,57.69 42.86,57.69 41.56,56.39 39.09,56.39 38.1,55.4 v1(38.1,55.04) 37.74,55.04 37.59,54.89 37.59,52.64 38.71,51.52 38.71,37.16 v1(38.46,36.91) ; v1(41.21,24.17) 40.89,24.49 20.84,24.49 v1(20.29,23.94)
SCL2_A: length 33.7
  Top Layer w0.152: v1(18.16,52.43) 19.14,52.43 U4.5 ; H5.2 6.73,47.97 v1(6.75,48) 7.01,47.75 7.01,45.04 7.37,44.68 R15.1
  Bottom Layer w0.152: v1(6.75,48) 7.13,48 7.52,48.39 7.52,58.42 8.99,59.89 14.38,59.89 17.4,56.87 17.4,53.19 v1(18.16,52.43)
SCL2_B: length 28.8
  Top Layer w0.152: H6.2 51.2,46.98 51.54,47.32 51.54,49.84 51.43,49.95 v1(51.07,49.95) ; U4.35 37.71,51.27 39.23,52.79 R17.1 39.75,54.23 42.32,54.23 42.41,54.32 42.69,54.32 42.73,54.36 v1(42.77,54.32)
  Bottom Layer w0.152: v1(42.77,54.32) 42.42,54.67 42.42,56.45 43.09,57.13 48.13,57.13 49.61,55.65 49.61,51.57 51.07,50.11 v1(51.07,49.95)
SCLK: length 32.8
  Top Layer w0.152: H12.3 26.65,31.49 26.67,31.47 ; U5.13 28,37.37 28.19,37.57 28.62,37.57 v1(28.65,37.54) ; 26.67,31.47 26.67,29.44 26.03,28.81 26.03,27.53 25.53,27.03 24.65,27.03 R30.1 ; 26.67,31.47 26.9,31.47 27.98,32.56 v1(27.98,33) ; U4.15 21.08,39.9 v1(21.08,41.38)
  Bottom Layer w0.152: v1(21.08,41.38) 21.21,41.5 28.32,41.5 29,40.83 29,37.89 v1(28.65,37.54) 28.65,34.11 27.98,33.45 v1(27.98,33)
SDA2_A: length 31.7
  Top Layer w0.152: v1(18.03,53.7) 19.14,53.7 U4.4 ; R14.1 7.75,45.95 7.29,46.41 7.29,48.57 v1(6.98,48.87) 5.72,48.87 H5.1
  Bottom Layer w0.152: v1(18.03,53.7) 17.68,54.05 17.68,56.99 14.49,60.17 8.64,60.17 7.24,58.78 7.24,49.12 v1(6.98,48.87)
SDA2_B: length 31.2
  Top Layer w0.152: v1(51.19,50.75) 51.19,50.58 51.82,49.96 51.82,46.84 50.96,45.98 H6.1 ; U4.34 37.07,50 37.72,50.65 37.72,50.86 38.9,52.05 40,52.05 40.71,52.75 R16.1 40.95,53.95 41.78,53.95 v1(42.04,53.7)
  Bottom Layer w0.152: v1(42.04,53.7) 42.14,53.8 42.14,56.57 42.97,57.41 48.35,57.41 49.89,55.87 49.89,51.69 50.83,50.75 v1(51.19,50.75)
SERVO1: length 36.9
  Top Layer w0.152: H9.1 10.92,34.01 12.05,32.88 20.97,32.88 21.74,33.66 21.74,38.47 21.86,38.59 25.63,38.59 25.78,38.74 25.78,39.52 U4.19 26.09,39.54 26.71,38.93 27.33,38.93 27.61,38.65 30.08,38.65 30.73,38 39.19,38 39.47,37.73 CN3.1
SERVO2: length 36.1
  Top Layer w0.152: H9.2 14.19,33.16 20.85,33.16 21.46,33.77 21.46,38.58 21.75,38.87 25.28,38.87 25.43,39.02 25.43,40.64 25.65,40.87 27.18,40.87 27.37,40.68 U4.20 27.37,39.29 27.72,38.93 30.2,38.93 30.85,38.28 39.06,38.28 39.51,38.73 CN3.2
SERVO3: length 29.9
  Top Layer w0.152: H10.1 45.84,27.92 46.1,27.92 46.35,28.17 46.35,31.85 45.86,32.35 41.78,32.35 41.12,33.01 41.12,39.24 40.64,39.73 CN3.3 39.5,39.73 38.33,38.56 30.96,38.56 29.91,39.61 U4.22
SERVO4: length 33.6
  Top Layer w0.152: H10.2 42.53,28.44 43.43,27.53 46.23,27.53 46.63,27.94 46.63,31.97 45.98,32.63 41.9,32.63 41.4,33.12 41.4,39.85 40.53,40.73 CN3.4 39.61,40.73 37.72,38.84 31.33,38.84 31.18,38.99 U4.23
TX0: length 50.2
  Top Layer w0.152: H1.4 51.26,14.05 51.26,15.78 50.05,17 47.88,17 47.57,17.31 R7.1 47.88,21.06 47.03,21.91 44.62,21.91 38.79,27.74 38.79,35.16 v1(39.04,35.41) ; U4.37 36.86,53.7 v1(38.13,53.7)
  Bottom Layer w0.152: v1(38.13,53.7) 38.66,53.16 38.66,52.38 39.27,51.77 39.27,35.64 v1(39.04,35.41)
TX1: length 38.5
  Top Layer w0.152: 4.35,53.09 4.42,53.09 4.7,52.81 4.7,51.93 3.43,50.66 3.43,36.54 4.81,35.16 14.48,35.16 15.24,35.92 15.24,37.44 15.53,37.73 CN4.5 16.03,37.69 17.27,37.69 18.16,38.58 18.16,40.97 18.31,41.12 19.24,41.12 U4.14
TX2: length 19
  Top Layer w0.152: U4.38 37.31,55.08 37.88,54.51 41.58,54.51 41.94,54.86 v1(41.94,57.52) ; H3.4 51.56,55.98 51,55.98 v1(50.62,56.36)
  Bottom Layer w0.152: v1(50.62,56.36) 50.18,56.36 48.58,57.96 42.62,57.96 42.17,57.52 v1(41.94,57.52)
U_A: length 8.6
  Top Layer w0.203: U6.2 9.44,48.53 9.4,48.49 ; U6.1 9.04,48.34 9.14,48.24
  Top Layer w0.508: H7.1 11.56,42.65 11.56,45.03 C18.2
U_B: length 24
  Top Layer w0.152: v1(46.81,53.7) 46.81,56.82 47.12,57.13 47.88,57.13 48.46,57.71 C25.2
  Bottom Layer w0.508: H8.1 46.81,38.79 v1(46.81,53.7)
  vias: v1(47.5,53.7)
V_A: length 11.2
  Top Layer w0.203: 11.05,48.24 11.04,48.25 U6.6 ; 11.43,48.24 11.44,48.25 U6.7
  Top Layer w0.508: 10.97,47.33 10.97,46.66 12.32,45.31 12.32,40.87 H7.2
V_B: length 18.3
  Top Layer w0.152: 44.65,55.49 44.66,55.49 U7.7
  Bottom Layer w0.508: v1(44.88,53.7) 44.88,48.29 43.31,46.71 43.31,41.12 H8.2
  vias: v1(44.2,53.7)
VERSION_ADC: length 9.9
  Top Layer w0.152: R42.1 R40.2 18.93,38.21 20.32,39.6 20.32,43.03 19.7,43.65 U4.12
VSTA: length 29.9
  Top Layer w0.152: v1(20.7,45.19) 19.52,45.19 U4.11 19.25,44.81 16.71,44.81 C36.1
  Bottom Layer w0.152: M1.3 34.79,34.7 34.79,41.6 32.69,43.7 20.6,43.7 20.45,43.85 20.45,44.93 v1(20.7,45.19)
W_A: length 22.8
  Top Layer w0.203: 9.72,57 9.72,56.3 9.44,56.02 U6.29
  Bottom Layer w0.508: v1(9.14,55.35) 9.02,55.22 9.02,37.57 9.65,36.93 H7.3
  vias: v1(9.14,55.98)
W_B: length 4.3
  Top Layer w0.508: H8.3 46.67,43.73 C27.1
$1N2260: length 3.6
  Top Layer w0.152: R34.2 R3.1 26.81,21.05 27.31,20.55 U1.4
$1N2389: length 7.9
  Top Layer w0.152: C5.1 20.49,17.4 25.88,17.4 26.42,16.87 27.79,16.87 U1.1
$1N3025: length 3.4
  Top Layer w0.152: USB1.10 38.96,8.26 38.13,9.09 38.13,9.73 38.41,10.01 R5.2
$1N3041: length 2.7
  Top Layer w0.152: R6.2 35.31,9.76 35.31,8.87 35.96,8.21 USB1.4
$1N3674: length 2.8
  Top Layer w0.152: 49.42,16.16 49.28,16.01 49.28,14.45 49.67,14.06 U3.10
$1N3733: length 3.8
  Top Layer w0.152: R7.2 47.88,15.22 49.54,13.56 U3.9
$1N3813: length 5
  Top Layer w0.152: U3.8 49.64,13.06 46.59,16.11 R8.2
$1N3996: length 2.2
  Top Layer w0.152: R11.1 16.76,59.56 LED1.2
$1N4673: length 86.3
  Top Layer w0.152: U4.3 20.21,55.08 20.57,54.71 v1(20.57,51.18) ; v1(45.97,10.64) R19.1 ; v1(17.8,48.76) 17.78,48.74 R20.1 16.76,47.4 C16.2 ; v1(34.26,41.38) 35.05,41.38 36.19,40.23 37.47,40.23 37.85,40.62 37.85,40.97 39.06,42.18 41.22,42.18 43.4,40 43.4,35.44 43.84,35 50.45,35 50.64,34.81 v1(50.71,34.81)
  Bottom Layer w0.152: 20.19,48.61 17.94,48.61 v1(17.8,48.76) ; 20.19,48.61 20.17,48.59 20.17,43.58 20.32,43.42 32.58,43.42 34.26,41.74 v1(34.26,41.38) ; 20.19,48.61 20.57,49 v1(20.57,51.18) ; v1(50.71,34.81) 50.75,34.77 50.75,34.34 50.55,34.14 50.55,10.9 50.39,10.75 46.08,10.75 v1(45.97,10.64)
$1N5206: length 1.5
  Top Layer w0.152: R9.2 40.74,58.04 LED2.1
$1N8578: length 2.5
  Top Layer w0.152: Q1.1 16.58,24.48 R12.2
$1N8581: length 4.3
  Top Layer w0.152: H4.3 12.96,22.97 R12.1
$1N10550: length 47.3
  Top Layer w0.762: H9.3 H9.4 14.42,31.47 16.33,29.57 17.27,29.57
  Top Layer w1.016: H11.2 44.45,23.09 40.51,27.03 40.51,30.2 41.53,31.22 H10.4 H10.3
  Bottom Layer w0.762: H10.4 42.04,31.22 40.39,29.57 17.4,29.57
  vias: v1(17.27,29.82) v1(17.27,29.19) v1(17.91,29.82) v1(17.91,29.19)
$1N10925: length 4.1
  Top Layer w0.152: U6.38 7.94,50.84 7.62,50.52 7.62,47.54 C18.1
$1N11051: length 2.1
  Top Layer w0.152: U6.10 12.64,47.6 C19.1
$1N11092: length 5.2
  Top Layer w0.152: U6.33 7.84,52.84 7.37,53.32 7.37,56.04 8.31,56.98
$1N11138: length 2.1
  Top Layer w0.152: C21.1 7.54,52.44 U6.34
$1N11195: length 2
  Top Layer w0.152: C22.1 7.26,51.24 U6.37
$1N13944: length 4
  Top Layer w0.152: R22.2 16.21,54.48 14.63,54.48 13.79,53.64 U6.20
$1N13948: length 2.2
  Top Layer w0.152: R21.2 14.53,53.24 U6.19
$1N13984: length 2.2
  Top Layer w0.152: D2.1 14.69,51.24 U6.14
$1N14018: length 4.1
  Top Layer w0.152: U6.17 15.13,52.44 15.32,52.63 D2.2 15.41,53.06 16.13,53.06 16.65,52.55 R23.2
$1N14887: length 6.6
  Top Layer w0.152: U7.38 48.34,51.25 48.9,51.82 48.9,56.12 49.08,56.3 49.78,56.3
$1N14892: length 2.8
  Top Layer w0.152: U7.10 43.46,55.26 C26.1
$1N14893: length 4.3
  Top Layer w0.152: U7.33 48.21,49.25 48.36,49.1 48.36,45.8 48.15,45.58 48.08,45.58
$1N14895: length 2.5
  Top Layer w0.152: C28.1 49.72,50.71 48.66,49.65 U7.34
$1N14897: length 4.1
  Top Layer w0.152: C29.1 49.34,53.5 49.18,53.35 49.18,51.7 48.34,50.85 U7.37
$1N14906: length 2.5
  Top Layer w0.152: U7.20 42,48.45 40.89,47.34 R25.2
$1N14908: length 4.3
  Top Layer w0.152: R24.2 39.23,47.59 39.62,47.98 41.02,47.98 41.89,48.85 U7.19
$1N14914: length 4.8
  Top Layer w0.152: 38.78,50.18 38.78,50.7 39.29,51.21 41.68,51.21 42.04,50.85 U7.14
$1N14916: length 3.8
  Top Layer w0.152: U7.17 42.02,49.65 41.49,50.18 D3.2 40.81,50.18 40.51,49.89 40.51,48.97 R26.2
$1N18308: length 1.4
  Top Layer w0.152: LED3.1 39.21,58.02 R32.2
$1N24341: length 1.3
  Top Layer w0.152: R34.1 R33.2
$1N42515: length 6
  Top Layer w0.152: Q2.4 29.3,10.3 29.46,10.14 v1(29.46,9.75) ; U8.1 27.11,13.37 27.18,13.3 v1(27.18,12.55)
  Bottom Layer w0.152: v1(27.18,12.55) 27.18,12.33 29.46,10.05 v1(29.46,9.75)
$1N42523: length 4.5
  Top Layer w0.152: U8.2 26.16,13.56 26.57,13.16 26.57,12.35 27.12,11.8 27.5,11.8 27.69,11.6 Q2.2
$1N46033: length 6.2
  Top Layer w0.152: U8.5 26.16,11.41 25.77,11.8 22.39,11.8 22.24,11.65 C34.2 22.36,11.08 R35.2
$1N46092: length 4
  Top Layer w0.152: R36.2 24.64,10.4 24.64,10.77 24.38,11.03 23.82,11.03 C35.2 23.84,11.41 25,11.41 U8.4

## Copper pours and planes (outline as drawn; the poured copper is in the pictures)
+5V on Top Layer: 38.37,21.38 45.85,21.38 45.85,19.66 38.37,19.66
+5V on Top Layer: 31.24,21.95 36.07,21.95 36.64,21.38 40.73,21.38 40.77,21.34 40.77,19.66 38.74,19.66 37.97,18.9 36.58,18.9 35.69,19.79 31.24,19.79
+5V on Top Layer: 31.24,21.95 40.77,21.95 40.77,18.9 31.24,18.9
+5V on Top Layer: 17.08,27.22 18.22,27.22 18.22,26.07 17.08,26.07
+5V on Bottom Layer: 17.08,27.22 18.22,27.22 18.22,26.07 17.08,26.07
GND on Top Layer: 28.19,13.18 29.46,13.18 29.46,12.04 28.19,12.04
GND on Top Layer: 0,64.87 55.37,64.87 56.26,63.98 56.26,1.88 53.97,-0.41 1.02,-0.41 -0.38,0.99 -0.38,64.49
GND on Bottom Layer: 0,65 54.99,65 56.26,63.73 56.26,1.37 54.36,-0.53 1.52,-0.53 -0.38,1.37 -0.38,64.62
VBUS on Top Layer: 36.56,6.33 37.97,6.33 37.97,5.18 36.56,5.18
VBUS on Bottom Layer: 36.58,6.58 37.97,6.58 37.97,5.18 36.58,5.18
VIN on Top Layer: 44.96,47.09 46.33,47.09 46.33,45.7 44.96,45.7
VIN on Top Layer: 18.29,22.58 19.94,22.58 20.07,22.45 20.07,21.19 19.81,20.93 18.54,20.93 18.03,21.44 18.03,22.33
VIN on Top Layer: 9.65,49.51 10.79,49.51 10.79,47.6 10.54,47.35 10.03,47.35 9.65,47.73
VIN on Top Layer: 7.87,60.43 11.43,60.43 11.43,55.09 7.87,55.09
VIN on Top Layer: 42.8,59.03 46.35,59.03 46.35,53.44 42.8,53.44
VIN on Top Layer: 6.98,18.26 9.02,18.26 9.02,13.69 6.98,13.69
VIN on Top Layer: 18.03,11.53 18.03,16.49 16.89,17.63 16.89,21.69 17.02,21.82 19.3,21.82 19.81,21.31 19.81,19.79 19.94,19.66 20.7,19.66 21.34,19.03 22.99,19.03 23.11,18.9 23.11,17.63 22.99,17.5 20.96,17.5 20.83,17.63 20.83,17.88 20.57,18.14 19.81,18.14 19.69,18.01 19.69,13.18 20.19,12.68 20.19,10.9 20.07,10.77 18.8,10.77
VIN on Top Layer: 46.35,47.09 45.21,47.09 44.96,46.84 44.96,46.33 45.59,45.7 45.85,45.7 46.35,46.2
VIN on Top Layer: 9.68,48.72 10.77,48.72 10.77,47.35 9.68,47.35
VIN on Bottom Layer: 44.96,46.97 46.35,46.97 46.35,45.82 44.96,45.82
VIN on Bottom Layer: 18.16,14.45 19.56,14.45 19.56,13.06 18.16,13.06
VIN on Bottom Layer: 6.86,18.26 8.37,18.26 8.37,13.69 6.86,13.69
VIN on Bottom Layer: 9.65,48.62 10.67,48.62 10.79,48.49 10.79,47.98 10.29,47.47 9.91,47.47 9.65,47.73
VIN on Bottom Layer: 10.32,56.38 9.65,55.72 9.65,55.35 9.91,55.09 10.92,55.09 10.92,56.36 10.91,56.38
VIN on Bottom Layer: 10.03,58.65 11.43,58.65 11.43,57.38 10.03,57.38
VIN on Bottom Layer: 44.83,56.87 46.35,56.87 46.35,55.73 44.83,55.73
VIN on Bottom Layer: 18.03,22.84 20.07,22.84 20.07,20.93 18.03,20.93
VIN on Bottom Layer: 45.21,54.97 46.48,54.97 46.48,54.08 45.21,54.08
B- on Top Layer: 29.08,7.85 27.18,9.75 27.18,11.25 29.24,11.25 29.24,9.22 30.23,8.23 29.84,7.85
U_B on Top Layer: 46.51,54.08 47.75,54.08 47.75,53.19 46.51,53.19
U_B on Top Layer: 46.48,52.68 46.48,53.82 46.74,54.08 47.62,54.08 47.75,53.95 47.75,53.32 47.62,53.19 47.37,53.19 47.24,53.06 47.24,52.68
U_B on Bottom Layer: 46.48,54.08 47.83,54.08 47.83,53.32 46.48,53.32
V_A on Top Layer: 10.92,48.62 11.56,48.62 11.56,47.98 10.92,47.35 10.67,47.35 10.67,47.86 10.92,48.11
V_A on Top Layer: 10.67,48.62 11.56,48.62 11.56,47.35 10.67,47.35
V_B on Top Layer: 45.23,52.68 45.23,53.82 44.98,54.08 44.09,54.08 43.96,53.95 43.96,53.32 44.09,53.19 44.34,53.19 44.47,53.06 44.47,52.68
V_B on Bottom Layer: 43.81,54.08 45.21,54.08 45.21,53.32 43.81,53.32
W_A on Top Layer: 9.53,55.73 9.91,56.11 9.91,56.87 10.03,57 9.4,57 9.4,56.62 9.27,56.49 8.89,56.49 8.76,56.36 8.76,54.08 9.53,54.08
W_A on Bottom Layer: 8.76,56.36 9.53,56.36 9.53,54.97 8.76,54.97
W_B on Top Layer: 46.48,48.11 47.37,48.11 47.37,46.27 46.67,45.57 46.48,45.76
$1N2414 on Top Layer: 34.42,16.23 38.48,16.23 38.48,14.07 34.42,14.07
$1N2414 on Top Layer: 21.59,17.12 25.86,17.12 26.67,16.32 34.59,16.32 35.05,15.85 35.05,14.33 34.67,13.95 31.37,13.95 31.24,14.07 29.97,14.07 29.08,14.96 26.03,14.96 25.15,15.85 20.13,15.85 20,15.98 20,16.87 21.34,16.87
$1N10550 on Top Layer: 17.02,30.08 18.16,30.08 18.16,28.93 17.02,28.93
$1N10550 on Bottom Layer: 17.02,30.08 18.16,30.08 18.16,28.93 17.02,28.93
$1N30381 on Top Layer: 41.02,13.06 44.2,13.06 44.2,12.3 41.02,12.3
$1N31293 on Top Layer: 30.14,12.44 31.79,12.44 31.79,10.15 30.14,10.15

Small or netless copper shapes (teardrops, artwork), in the pictures only: 19 on Top Layer, 8 on Bottom Layer

## Text on the board
Bottom Silkscreen Layer: VBUS | GND | B2 | B1 | STA | M3
Top Silkscreen Layer: Y | Z | X | BAT / ACTIVATE | GND | 5V | RX1 | TX1 | S4 | S3 | S2 | S1 | CODER | SDA | SCL | 3.3V | RX2 | TX2 | RX0 | TX0 | SBUS | MOTOR | SERVO | + | S | - | VIN | RST | BOOT | VERSION:1.2 | ES02-BETA | 2 | 1 | 4 | 3 | NavBot | ESP32-S3 | OFF | ON | ES02
